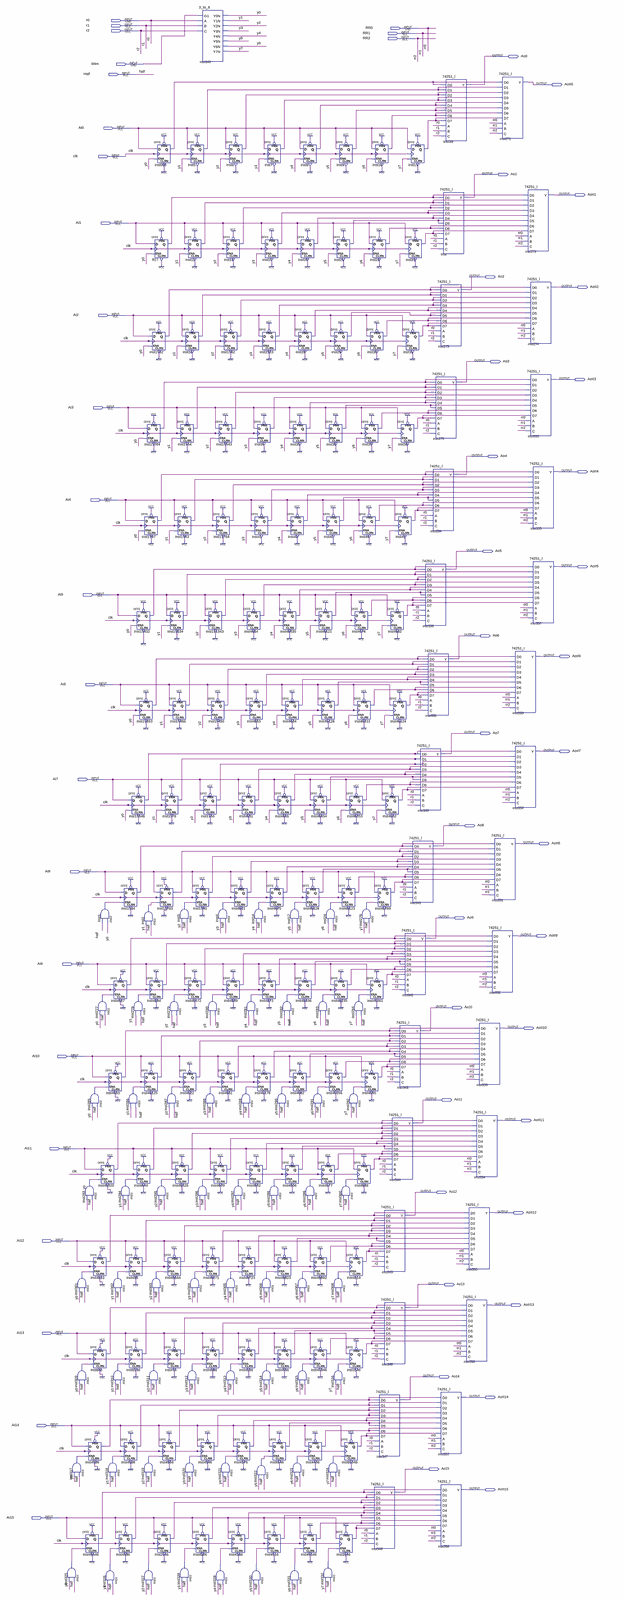
[diagram p0: schematic sheet, whole]
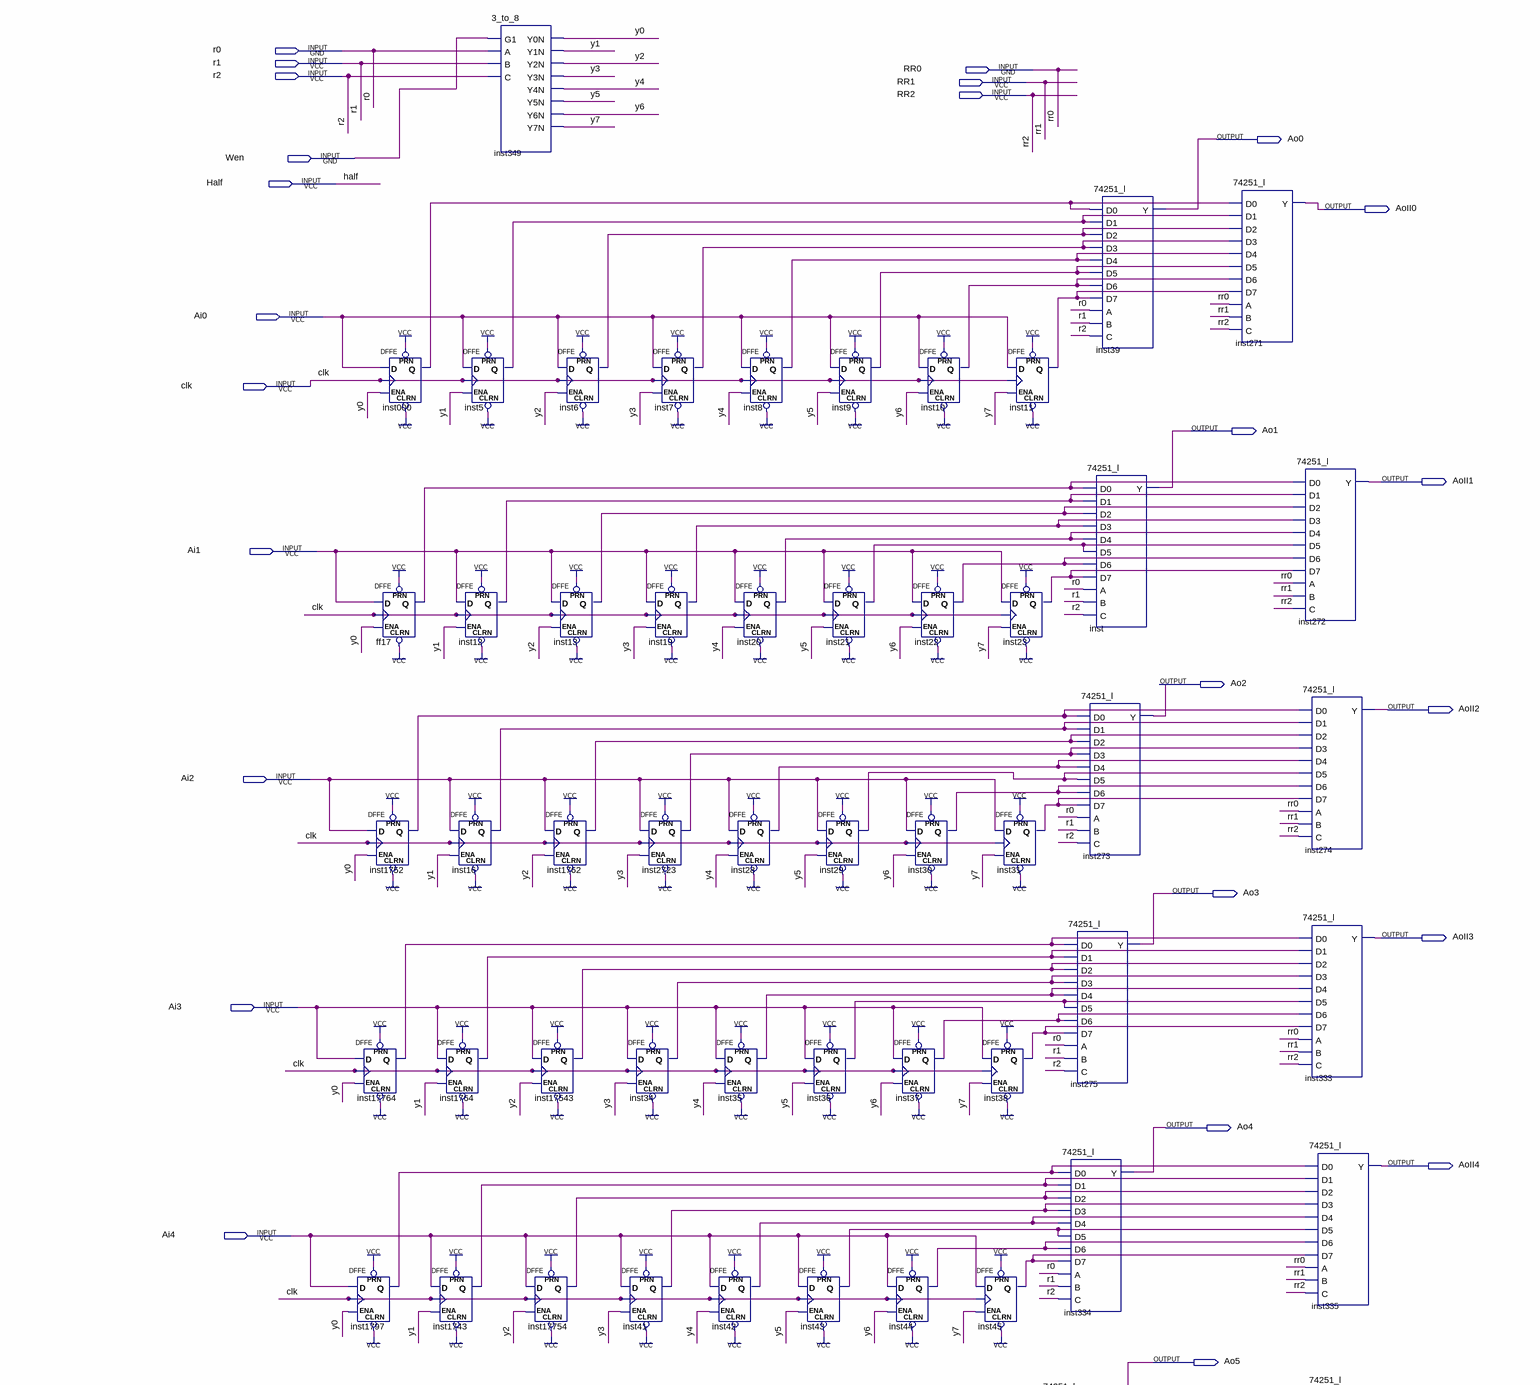
[diagram p1: schematic sheet, upper part]
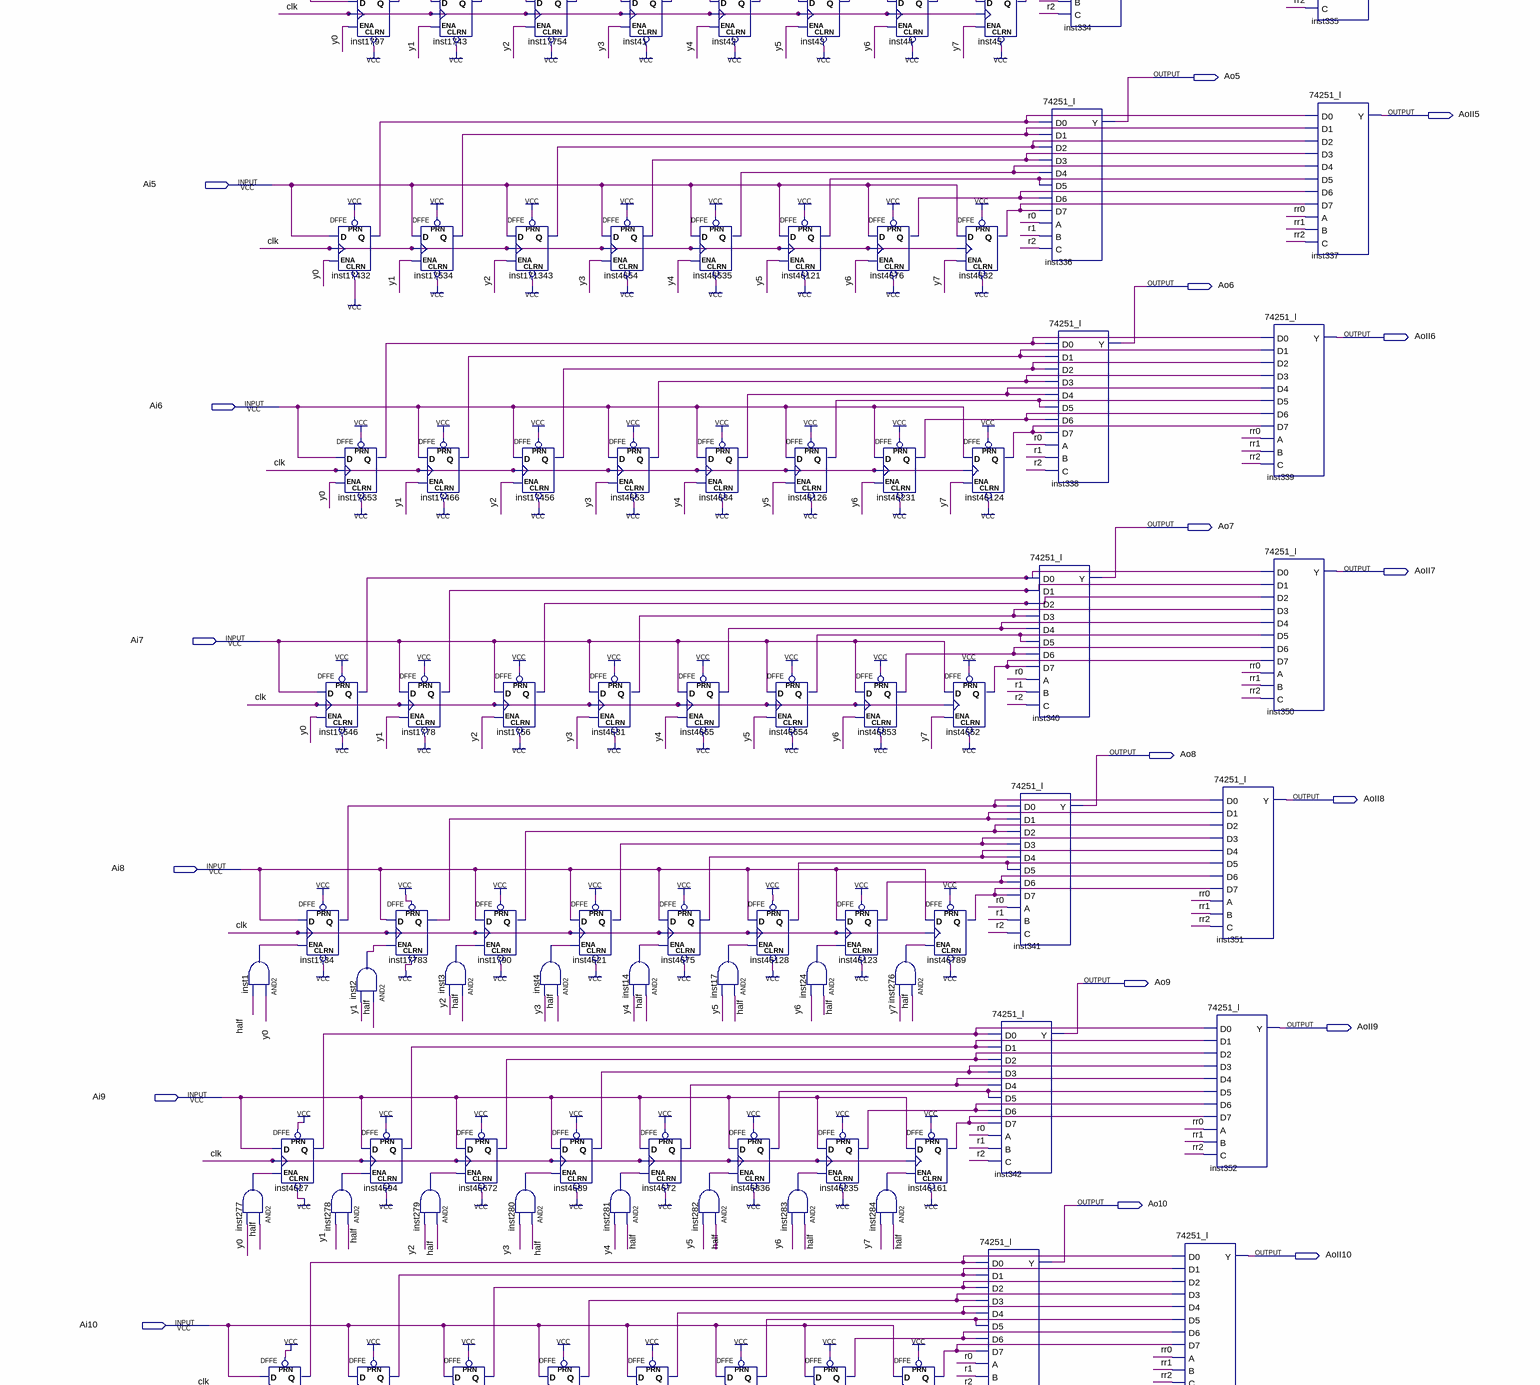
[diagram p2: schematic sheet, middle part]
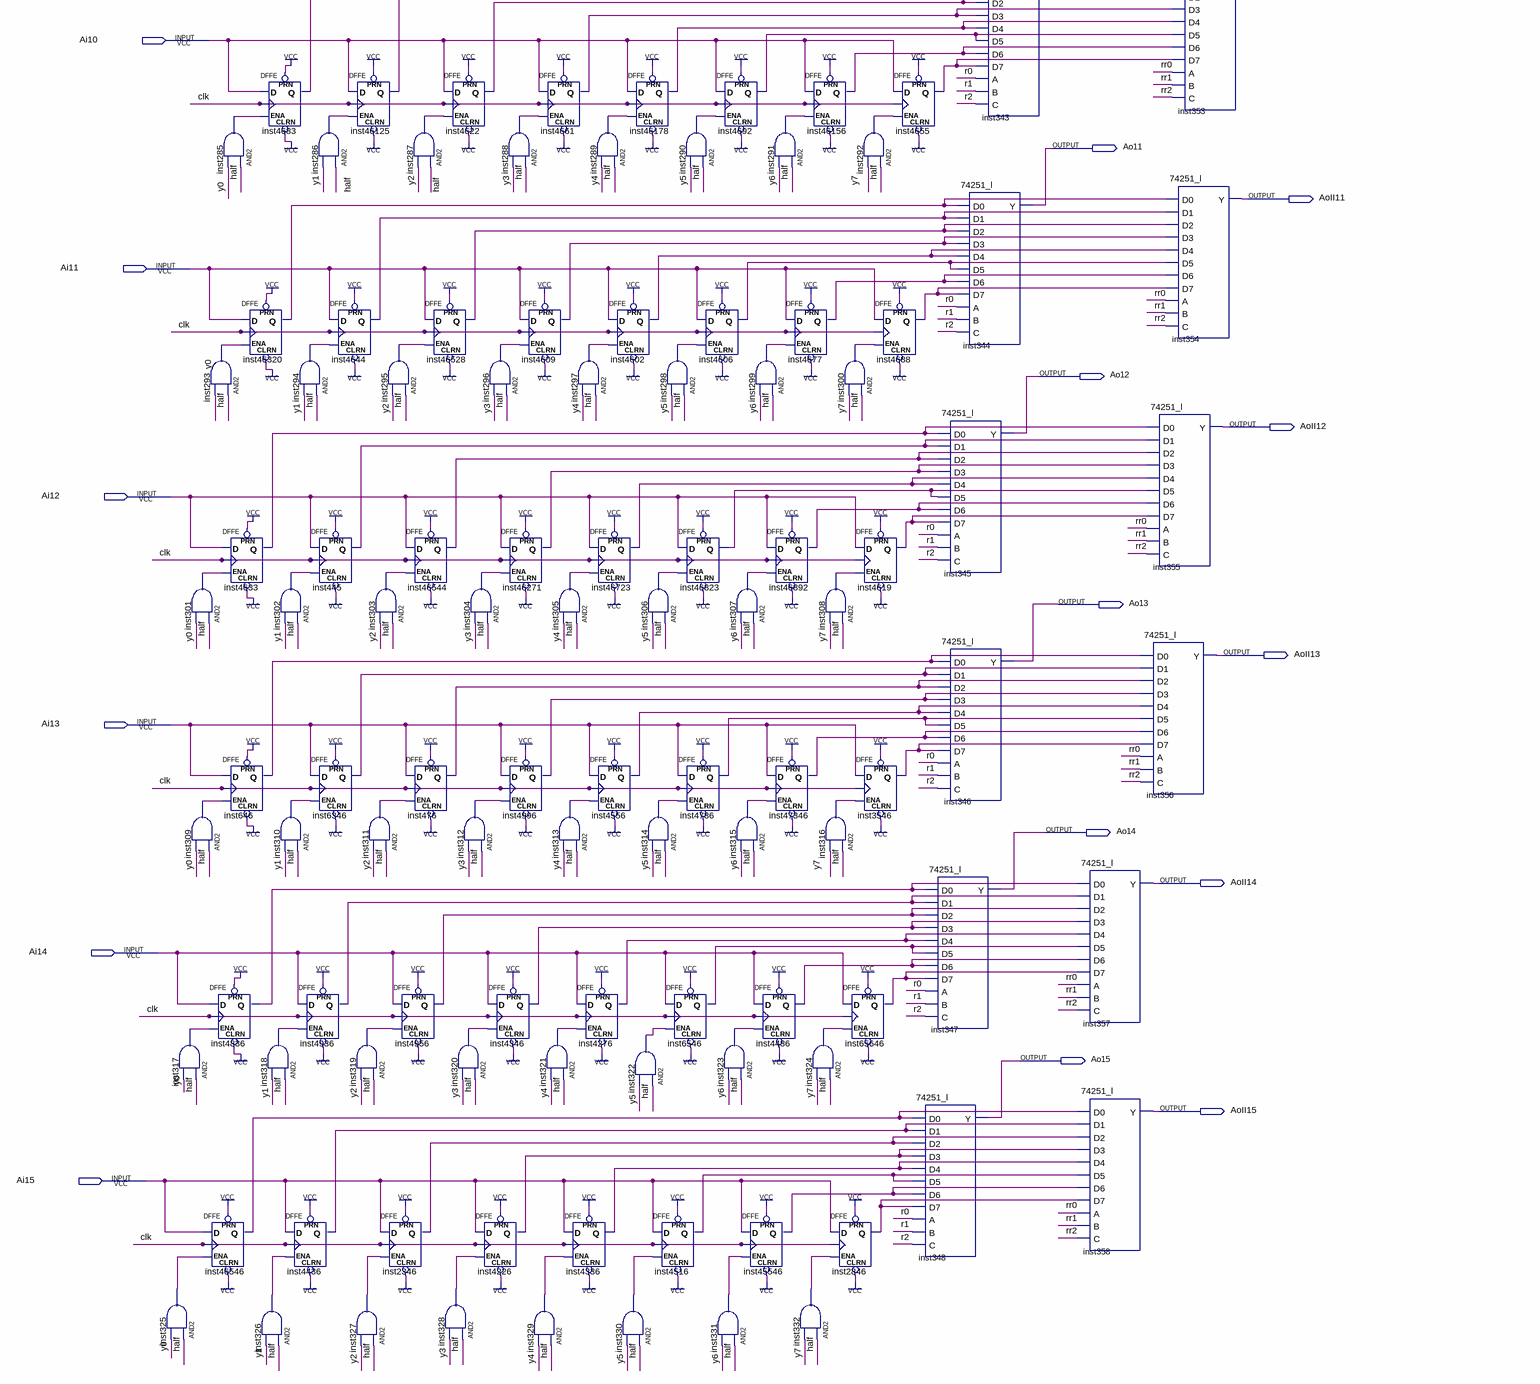
[diagram p3: schematic sheet, lower part]
// Quartus schematic regs.bdf as structural Verilog: 225 symbols, 57 pins
module regs (
  input  r0,
  input  r1,
  input  RR0,
  input  r2,
  input  RR1,
  input  RR2,
  input  Wen,
  input  Half,
  input  Ai0,
  input  clk,
  input  Ai1,
  input  Ai2,
  input  Ai3,
  input  Ai4,
  input  Ai5,
  input  Ai6,
  input  Ai7,
  input  Ai8,
  input  Ai9,
  input  Ai10,
  input  Ai11,
  input  Ai12,
  input  Ai13,
  input  Ai14,
  input  Ai15,
  output Ao0,
  output AoII0,
  output Ao1,
  output AoII1,
  output Ao2,
  output AoII2,
  output Ao3,
  output AoII3,
  output Ao4,
  output AoII4,
  output Ao5,
  output AoII5,
  output Ao6,
  output AoII6,
  output Ao7,
  output AoII7,
  output Ao8,
  output AoII8,
  output Ao9,
  output AoII9,
  output Ao10,
  output AoII10,
  output Ao11,
  output AoII11,
  output Ao12,
  output AoII12,
  output Ao13,
  output AoII13,
  output Ao14,
  output AoII14,
  output Ao15,
  output AoII15
);

  wire ff17_q, inst000_q, inst1_out, inst2_out, inst3_out, inst4_out, inst5_q, inst6_q, inst7_q, inst8_q,
       inst9_q, inst10_q, inst11_q, inst12_q, inst13_q, inst14_out, inst16_q, inst17_out, inst19_q, inst20_q,
       inst21_q, inst22_q, inst23_q, inst24_out, inst28_q, inst29_q, inst30_q, inst31_q, inst34_q, inst35_q,
       inst36_q, inst37_q, inst38_q, inst41_q, inst42_q, inst43_q, inst44_q, inst45_q, inst276_out,
       inst277_out, inst278_out, inst279_out, inst280_out, inst281_out, inst282_out, inst283_out,
       inst284_out, inst285_out, inst286_out, inst287_out, inst288_out, inst289_out, inst290_out,
       inst291_out, inst292_out, inst293_out, inst294_out, inst295_out, inst296_out, inst297_out,
       inst298_out, inst299_out, inst300_out, inst301_out, inst302_out, inst303_out, inst304_out,
       inst305_out, inst306_out, inst307_out, inst308_out, inst309_out, inst310_out, inst311_out,
       inst312_out, inst313_out, inst314_out, inst315_out, inst316_out, inst317_out, inst318_out,
       inst319_out, inst320_out, inst321_out, inst322_out, inst323_out, inst324_out, inst325_out,
       inst326_out, inst327_out, inst328_out, inst329_out, inst330_out, inst331_out, inst332_out, inst445_q,
       inst476_q, inst646_q, inst1734_q, inst1743_q, inst1752_q, inst1756_q, inst1762_q, inst1764_q,
       inst1778_q, inst1790_q, inst1797_q, inst2346_q, inst2723_q, inst2846_q, inst3546_q, inst4226_q,
       inst4276_q, inst4336_q, inst4346_q, inst4436_q, inst4486_q, inst4516_q, inst4556_q, inst4602_q,
       inst4606_q, inst4609_q, inst4619_q, inst4621_q, inst4622_q, inst4627_q, inst4631_q, inst4632_q,
       inst4633_q, inst4634_q, inst4644_q, inst4652_q, inst4653_q, inst4654_q, inst4655_q, inst4661_q,
       inst4665_q, inst4672_q, inst4675_q, inst4676_q, inst4677_q, inst4683_q, inst4688_q, inst4689_q,
       inst4692_q, inst4694_q, inst4786_q, inst4836_q, inst4936_q, inst4956_q, inst4996_q, inst6346_q,
       inst6546_q, inst17432_q, inst17456_q, inst17466_q, inst17534_q, inst17543_q, inst17546_q, inst17653_q,
       inst17754_q, inst17764_q, inst17783_q, inst45546_q, inst46121_q, inst46123_q, inst46124_q,
       inst46125_q, inst46126_q, inst46128_q, inst46156_q, inst46161_q, inst46178_q, inst46231_q,
       inst46235_q, inst46271_q, inst46320_q, inst46528_q, inst46535_q, inst46544_q, inst46546_q,
       inst46654_q, inst46672_q, inst46723_q, inst46789_q, inst46823_q, inst46836_q, inst46853_q,
       inst46892_q, inst47346_q, inst65646_q, inst171343_q, y0, y1, y2, y3, y4, y5, y6, y7;

  and inst301 (inst301_out, Half, y0);
  and inst309 (inst309_out, Half, y0);
  and inst317 (inst317_out, Half, y0);
  and inst325 (inst325_out, Half, y0);
  and inst1 (inst1_out, y0, Half);
  and inst277 (inst277_out, Half, y0);
  and inst285 (inst285_out, Half, y0);
  DFFE inst46320 (.PRN(1'b1), .CLRN(1'b1), .D(Ai11), .CLK(clk), .ENA(inst293_out), .Q(inst46320_q));
  and inst293 (inst293_out, Half, y0);
  DFFE inst4633 (.PRN(1'b1), .CLRN(1'b1), .D(Ai12), .CLK(clk), .ENA(inst301_out), .Q(inst4633_q));
  DFFE inst646 (.PRN(1'b1), .CLRN(1'b1), .D(Ai13), .CLK(clk), .ENA(inst309_out), .Q(inst646_q));
  DFFE inst4836 (.PRN(1'b1), .CLRN(1'b1), .D(Ai14), .CLK(clk), .ENA(inst317_out), .Q(inst4836_q));
  DFFE inst46546 (.PRN(1'b1), .CLRN(1'b1), .D(Ai15), .CLK(clk), .ENA(inst325_out), .Q(inst46546_q));
  DFFE inst1734 (.PRN(1'b1), .CLRN(1'b1), .D(Ai8), .CLK(clk), .ENA(inst1_out), .Q(inst1734_q));
  DFFE inst4627 (.PRN(1'b1), .CLRN(1'b1), .D(Ai9), .CLK(clk), .ENA(inst277_out), .Q(inst4627_q));
  DFFE inst4683 (.PRN(1'b1), .CLRN(1'b1), .D(Ai10), .CLK(clk), .ENA(inst285_out), .Q(inst4683_q));
  and inst294 (inst294_out, Half, y1);
  and inst302 (inst302_out, Half, y1);
  and inst310 (inst310_out, Half, y1);
  DFFE inst4936 (.PRN(1'b1), .CLRN(1'b1), .D(Ai14), .CLK(clk), .ENA(inst318_out), .Q(inst4936_q));
  and inst318 (inst318_out, Half, y1);
  DFFE inst4436 (.PRN(1'b1), .CLRN(1'b1), .D(Ai15), .CLK(clk), .ENA(inst326_out), .Q(inst4436_q));
  and inst326 (inst326_out, Half, y1);
  DFFE inst1797 (.PRN(1'b1), .CLRN(1'b1), .D(Ai4), .CLK(clk), .ENA(y0), .Q(inst1797_q));
  DFFE inst17432 (.PRN(1'b1), .CLRN(1'b1), .D(Ai5), .CLK(clk), .ENA(y0), .Q(inst17432_q));
  DFFE inst17653 (.PRN(1'b1), .CLRN(1'b1), .D(Ai6), .CLK(clk), .ENA(y0), .Q(inst17653_q));
  DFFE inst17546 (.PRN(1'b1), .CLRN(1'b1), .D(Ai7), .CLK(clk), .ENA(y0), .Q(inst17546_q));
  and inst2 (inst2_out, Half, y1);
  and inst278 (inst278_out, Half, y1);
  DFFE inst46125 (.PRN(1'b1), .CLRN(1'b1), .D(Ai10), .CLK(clk), .ENA(inst286_out), .Q(inst46125_q));
  and inst286 (inst286_out, Half, y1);
  DFFE inst4644 (.PRN(1'b1), .CLRN(1'b1), .D(Ai11), .CLK(clk), .ENA(inst294_out), .Q(inst4644_q));
  DFFE inst445 (.PRN(1'b1), .CLRN(1'b1), .D(Ai12), .CLK(clk), .ENA(inst302_out), .Q(inst445_q));
  DFFE inst6346 (.PRN(1'b1), .CLRN(1'b1), .D(Ai13), .CLK(clk), .ENA(inst310_out), .Q(inst6346_q));
  and inst319 (inst319_out, Half, y2);
  and inst327 (inst327_out, Half, y2);
  DFFE inst000 (.PRN(1'b1), .CLRN(1'b1), .D(Ai0), .CLK(clk), .ENA(y0), .Q(inst000_q));
  DFFE ff17 (.PRN(1'b1), .CLRN(1'b1), .D(Ai1), .CLK(clk), .ENA(y0), .Q(ff17_q));
  DFFE inst1752 (.PRN(1'b1), .CLRN(1'b1), .D(Ai2), .CLK(clk), .ENA(y0), .Q(inst1752_q));
  DFFE inst17764 (.PRN(1'b1), .CLRN(1'b1), .D(Ai3), .CLK(clk), .ENA(y0), .Q(inst17764_q));
  DFFE inst1778 (.PRN(1'b1), .CLRN(1'b1), .D(Ai7), .CLK(clk), .ENA(y1), .Q(inst1778_q));
  DFFE inst17783 (.PRN(1'b1), .CLRN(1'b1), .D(Ai8), .CLK(clk), .ENA(inst2_out), .Q(inst17783_q));
  DFFE inst4694 (.PRN(1'b1), .CLRN(1'b1), .D(Ai9), .CLK(clk), .ENA(inst278_out), .Q(inst4694_q));
  and inst295 (inst295_out, Half, y2);
  and inst303 (inst303_out, Half, y2);
  and inst311 (inst311_out, Half, y2);
  DFFE inst4956 (.PRN(1'b1), .CLRN(1'b1), .D(Ai14), .CLK(clk), .ENA(inst319_out), .Q(inst4956_q));
  DFFE inst2346 (.PRN(1'b1), .CLRN(1'b1), .D(Ai15), .CLK(clk), .ENA(inst327_out), .Q(inst2346_q));
  DFFE inst16 (.PRN(1'b1), .CLRN(1'b1), .D(Ai2), .CLK(clk), .ENA(y1), .Q(inst16_q));
  DFFE inst1764 (.PRN(1'b1), .CLRN(1'b1), .D(Ai3), .CLK(clk), .ENA(y1), .Q(inst1764_q));
  DFFE inst1743 (.PRN(1'b1), .CLRN(1'b1), .D(Ai4), .CLK(clk), .ENA(y1), .Q(inst1743_q));
  DFFE inst17534 (.PRN(1'b1), .CLRN(1'b1), .D(Ai5), .CLK(clk), .ENA(y1), .Q(inst17534_q));
  DFFE inst17466 (.PRN(1'b1), .CLRN(1'b1), .D(Ai6), .CLK(clk), .ENA(y1), .Q(inst17466_q));
  and inst3 (inst3_out, Half, y2);
  and inst279 (inst279_out, Half, y2);
  DFFE inst4622 (.PRN(1'b1), .CLRN(1'b1), .D(Ai10), .CLK(clk), .ENA(inst287_out), .Q(inst4622_q));
  and inst287 (inst287_out, Half, y2);
  DFFE inst46528 (.PRN(1'b1), .CLRN(1'b1), .D(Ai11), .CLK(clk), .ENA(inst295_out), .Q(inst46528_q));
  DFFE inst46544 (.PRN(1'b1), .CLRN(1'b1), .D(Ai12), .CLK(clk), .ENA(inst303_out), .Q(inst46544_q));
  DFFE inst476 (.PRN(1'b1), .CLRN(1'b1), .D(Ai13), .CLK(clk), .ENA(inst311_out), .Q(inst476_q));
  and inst320 (inst320_out, Half, y3);
  and inst328 (inst328_out, Half, y3);
  \3_to_8  inst349 (
    .G1(Wen), .A(r0), .B(r1), .C(r2), .Y0N(y0), .Y1N(y1), .Y2N(y2), .Y3N(y3), .Y4N(y4), .Y5N(y5), .Y6N(y6),
    .Y7N(y7));
  DFFE inst5 (.PRN(1'b1), .CLRN(1'b1), .D(Ai0), .CLK(clk), .ENA(y1), .Q(inst5_q));
  DFFE inst12 (.PRN(1'b1), .CLRN(1'b1), .D(Ai1), .CLK(clk), .ENA(y1), .Q(inst12_q));
  DFFE inst1756 (.PRN(1'b1), .CLRN(1'b1), .D(Ai7), .CLK(clk), .ENA(y2), .Q(inst1756_q));
  DFFE inst1790 (.PRN(1'b1), .CLRN(1'b1), .D(Ai8), .CLK(clk), .ENA(inst3_out), .Q(inst1790_q));
  DFFE inst46672 (.PRN(1'b1), .CLRN(1'b1), .D(Ai9), .CLK(clk), .ENA(inst279_out), .Q(inst46672_q));
  and inst288 (inst288_out, Half, y3);
  and inst296 (inst296_out, Half, y3);
  DFFE inst46271 (.PRN(1'b1), .CLRN(1'b1), .D(Ai12), .CLK(clk), .ENA(inst304_out), .Q(inst46271_q));
  and inst304 (inst304_out, Half, y3);
  DFFE inst4996 (.PRN(1'b1), .CLRN(1'b1), .D(Ai13), .CLK(clk), .ENA(inst312_out), .Q(inst4996_q));
  and inst312 (inst312_out, Half, y3);
  DFFE inst4346 (.PRN(1'b1), .CLRN(1'b1), .D(Ai14), .CLK(clk), .ENA(inst320_out), .Q(inst4346_q));
  DFFE inst4226 (.PRN(1'b1), .CLRN(1'b1), .D(Ai15), .CLK(clk), .ENA(inst328_out), .Q(inst4226_q));
  DFFE inst13 (.PRN(1'b1), .CLRN(1'b1), .D(Ai1), .CLK(clk), .ENA(y2), .Q(inst13_q));
  DFFE inst1762 (.PRN(1'b1), .CLRN(1'b1), .D(Ai2), .CLK(clk), .ENA(y2), .Q(inst1762_q));
  DFFE inst17543 (.PRN(1'b1), .CLRN(1'b1), .D(Ai3), .CLK(clk), .ENA(y2), .Q(inst17543_q));
  DFFE inst17754 (.PRN(1'b1), .CLRN(1'b1), .D(Ai4), .CLK(clk), .ENA(y2), .Q(inst17754_q));
  DFFE inst171343 (.PRN(1'b1), .CLRN(1'b1), .D(Ai5), .CLK(clk), .ENA(y2), .Q(inst171343_q));
  DFFE inst17456 (.PRN(1'b1), .CLRN(1'b1), .D(Ai6), .CLK(clk), .ENA(y2), .Q(inst17456_q));
  and inst4 (inst4_out, Half, y3);
  DFFE inst4689 (.PRN(1'b1), .CLRN(1'b1), .D(Ai9), .CLK(clk), .ENA(inst280_out), .Q(inst4689_q));
  and inst280 (inst280_out, Half, y3);
  DFFE inst4661 (.PRN(1'b1), .CLRN(1'b1), .D(Ai10), .CLK(clk), .ENA(inst288_out), .Q(inst4661_q));
  DFFE inst4609 (.PRN(1'b1), .CLRN(1'b1), .D(Ai11), .CLK(clk), .ENA(inst296_out), .Q(inst4609_q));
  and inst305 (inst305_out, Half, y4);
  and inst313 (inst313_out, Half, y4);
  and inst321 (inst321_out, Half, y4);
  and inst329 (inst329_out, Half, y4);
  DFFE inst6 (.PRN(1'b1), .CLRN(1'b1), .D(Ai0), .CLK(clk), .ENA(y2), .Q(inst6_q));
  DFFE inst4654 (.PRN(1'b1), .CLRN(1'b1), .D(Ai5), .CLK(clk), .ENA(y3), .Q(inst4654_q));
  DFFE inst4631 (.PRN(1'b1), .CLRN(1'b1), .D(Ai7), .CLK(clk), .ENA(y3), .Q(inst4631_q));
  DFFE inst4621 (.PRN(1'b1), .CLRN(1'b1), .D(Ai8), .CLK(clk), .ENA(inst4_out), .Q(inst4621_q));
  and inst281 (inst281_out, Half, y4);
  and inst289 (inst289_out, Half, y4);
  and inst297 (inst297_out, Half, y4);
  DFFE inst46723 (.PRN(1'b1), .CLRN(1'b1), .D(Ai12), .CLK(clk), .ENA(inst305_out), .Q(inst46723_q));
  DFFE inst4556 (.PRN(1'b1), .CLRN(1'b1), .D(Ai13), .CLK(clk), .ENA(inst313_out), .Q(inst4556_q));
  DFFE inst4276 (.PRN(1'b1), .CLRN(1'b1), .D(Ai14), .CLK(clk), .ENA(inst321_out), .Q(inst4276_q));
  DFFE inst4336 (.PRN(1'b1), .CLRN(1'b1), .D(Ai15), .CLK(clk), .ENA(inst329_out), .Q(inst4336_q));
  DFFE inst7 (.PRN(1'b1), .CLRN(1'b1), .D(Ai0), .CLK(clk), .ENA(y3), .Q(inst7_q));
  DFFE inst19 (.PRN(1'b1), .CLRN(1'b1), .D(Ai1), .CLK(clk), .ENA(y3), .Q(inst19_q));
  DFFE inst2723 (.PRN(1'b1), .CLRN(1'b1), .D(Ai2), .CLK(clk), .ENA(y3), .Q(inst2723_q));
  DFFE inst34 (.PRN(1'b1), .CLRN(1'b1), .D(Ai3), .CLK(clk), .ENA(y3), .Q(inst34_q));
  DFFE inst41 (.PRN(1'b1), .CLRN(1'b1), .D(Ai4), .CLK(clk), .ENA(y3), .Q(inst41_q));
  DFFE inst4653 (.PRN(1'b1), .CLRN(1'b1), .D(Ai6), .CLK(clk), .ENA(y3), .Q(inst4653_q));
  and inst14 (inst14_out, Half, y4);
  DFFE inst4672 (.PRN(1'b1), .CLRN(1'b1), .D(Ai9), .CLK(clk), .ENA(inst281_out), .Q(inst4672_q));
  DFFE inst46178 (.PRN(1'b1), .CLRN(1'b1), .D(Ai10), .CLK(clk), .ENA(inst289_out), .Q(inst46178_q));
  DFFE inst4602 (.PRN(1'b1), .CLRN(1'b1), .D(Ai11), .CLK(clk), .ENA(inst297_out), .Q(inst4602_q));
  and inst306 (inst306_out, Half, y5);
  and inst314 (inst314_out, Half, y5);
  and inst322 (inst322_out, Half, y5);
  DFFE inst4516 (.PRN(1'b1), .CLRN(1'b1), .D(Ai15), .CLK(clk), .ENA(inst330_out), .Q(inst4516_q));
  and inst330 (inst330_out, Half, y5);
  DFFE inst46535 (.PRN(1'b1), .CLRN(1'b1), .D(Ai5), .CLK(clk), .ENA(y4), .Q(inst46535_q));
  DFFE inst4634 (.PRN(1'b1), .CLRN(1'b1), .D(Ai6), .CLK(clk), .ENA(y4), .Q(inst4634_q));
  DFFE inst4665 (.PRN(1'b1), .CLRN(1'b1), .D(Ai7), .CLK(clk), .ENA(y4), .Q(inst4665_q));
  DFFE inst4675 (.PRN(1'b1), .CLRN(1'b1), .D(Ai8), .CLK(clk), .ENA(inst14_out), .Q(inst4675_q));
  and inst282 (inst282_out, Half, y5);
  and inst290 (inst290_out, Half, y5);
  DFFE inst4606 (.PRN(1'b1), .CLRN(1'b1), .D(Ai11), .CLK(clk), .ENA(inst298_out), .Q(inst4606_q));
  and inst298 (inst298_out, Half, y5);
  DFFE inst46823 (.PRN(1'b1), .CLRN(1'b1), .D(Ai12), .CLK(clk), .ENA(inst306_out), .Q(inst46823_q));
  DFFE inst4786 (.PRN(1'b1), .CLRN(1'b1), .D(Ai13), .CLK(clk), .ENA(inst314_out), .Q(inst4786_q));
  DFFE inst6546 (.PRN(1'b1), .CLRN(1'b1), .D(Ai14), .CLK(clk), .ENA(inst322_out), .Q(inst6546_q));
  DFFE inst8 (.PRN(1'b1), .CLRN(1'b1), .D(Ai0), .CLK(clk), .ENA(y4), .Q(inst8_q));
  DFFE inst20 (.PRN(1'b1), .CLRN(1'b1), .D(Ai1), .CLK(clk), .ENA(y4), .Q(inst20_q));
  DFFE inst28 (.PRN(1'b1), .CLRN(1'b1), .D(Ai2), .CLK(clk), .ENA(y4), .Q(inst28_q));
  DFFE inst35 (.PRN(1'b1), .CLRN(1'b1), .D(Ai3), .CLK(clk), .ENA(y4), .Q(inst35_q));
  DFFE inst42 (.PRN(1'b1), .CLRN(1'b1), .D(Ai4), .CLK(clk), .ENA(y4), .Q(inst42_q));
  DFFE inst46128 (.PRN(1'b1), .CLRN(1'b1), .D(Ai8), .CLK(clk), .ENA(inst17_out), .Q(inst46128_q));
  and inst17 (inst17_out, Half, y5);
  DFFE inst46836 (.PRN(1'b1), .CLRN(1'b1), .D(Ai9), .CLK(clk), .ENA(inst282_out), .Q(inst46836_q));
  DFFE inst4692 (.PRN(1'b1), .CLRN(1'b1), .D(Ai10), .CLK(clk), .ENA(inst290_out), .Q(inst4692_q));
  and inst299 (inst299_out, Half, y6);
  and inst307 (inst307_out, Half, y6);
  and inst315 (inst315_out, Half, y6);
  DFFE inst4486 (.PRN(1'b1), .CLRN(1'b1), .D(Ai14), .CLK(clk), .ENA(inst323_out), .Q(inst4486_q));
  and inst323 (inst323_out, Half, y6);
  DFFE inst45546 (.PRN(1'b1), .CLRN(1'b1), .D(Ai15), .CLK(clk), .ENA(inst331_out), .Q(inst45546_q));
  and inst331 (inst331_out, Half, y6);
  DFFE inst36 (.PRN(1'b1), .CLRN(1'b1), .D(Ai3), .CLK(clk), .ENA(y5), .Q(inst36_q));
  DFFE inst43 (.PRN(1'b1), .CLRN(1'b1), .D(Ai4), .CLK(clk), .ENA(y5), .Q(inst43_q));
  DFFE inst46121 (.PRN(1'b1), .CLRN(1'b1), .D(Ai5), .CLK(clk), .ENA(y5), .Q(inst46121_q));
  DFFE inst46126 (.PRN(1'b1), .CLRN(1'b1), .D(Ai6), .CLK(clk), .ENA(y5), .Q(inst46126_q));
  DFFE inst46654 (.PRN(1'b1), .CLRN(1'b1), .D(Ai7), .CLK(clk), .ENA(y5), .Q(inst46654_q));
  and inst24 (inst24_out, Half, y6);
  and inst283 (inst283_out, Half, y6);
  DFFE inst46156 (.PRN(1'b1), .CLRN(1'b1), .D(Ai10), .CLK(clk), .ENA(inst291_out), .Q(inst46156_q));
  and inst291 (inst291_out, Half, y6);
  DFFE inst4677 (.PRN(1'b1), .CLRN(1'b1), .D(Ai11), .CLK(clk), .ENA(inst299_out), .Q(inst4677_q));
  DFFE inst46892 (.PRN(1'b1), .CLRN(1'b1), .D(Ai12), .CLK(clk), .ENA(inst307_out), .Q(inst46892_q));
  DFFE inst47346 (.PRN(1'b1), .CLRN(1'b1), .D(Ai13), .CLK(clk), .ENA(inst315_out), .Q(inst47346_q));
  and inst324 (inst324_out, Half, y7);
  and inst332 (inst332_out, Half, y7);
  DFFE inst9 (.PRN(1'b1), .CLRN(1'b1), .D(Ai0), .CLK(clk), .ENA(y5), .Q(inst9_q));
  DFFE inst21 (.PRN(1'b1), .CLRN(1'b1), .D(Ai1), .CLK(clk), .ENA(y5), .Q(inst21_q));
  DFFE inst29 (.PRN(1'b1), .CLRN(1'b1), .D(Ai2), .CLK(clk), .ENA(y5), .Q(inst29_q));
  DFFE inst46853 (.PRN(1'b1), .CLRN(1'b1), .D(Ai7), .CLK(clk), .ENA(y6), .Q(inst46853_q));
  DFFE inst46123 (.PRN(1'b1), .CLRN(1'b1), .D(Ai8), .CLK(clk), .ENA(inst24_out), .Q(inst46123_q));
  DFFE inst46235 (.PRN(1'b1), .CLRN(1'b1), .D(Ai9), .CLK(clk), .ENA(inst283_out), .Q(inst46235_q));
  and inst292 (inst292_out, Half, y7);
  and inst300 (inst300_out, Half, y7);
  DFFE inst4619 (.PRN(1'b1), .CLRN(1'b1), .D(Ai12), .CLK(clk), .ENA(inst308_out), .Q(inst4619_q));
  and inst308 (inst308_out, Half, y7);
  DFFE inst3546 (.PRN(1'b1), .CLRN(1'b1), .D(Ai13), .CLK(clk), .ENA(inst316_out), .Q(inst3546_q));
  and inst316 (inst316_out, Half, y7);
  DFFE inst65646 (.PRN(1'b1), .CLRN(1'b1), .D(Ai14), .CLK(clk), .ENA(inst324_out), .Q(inst65646_q));
  DFFE inst2846 (.PRN(1'b1), .CLRN(1'b1), .D(Ai15), .CLK(clk), .ENA(inst332_out), .Q(inst2846_q));
  DFFE inst30 (.PRN(1'b1), .CLRN(1'b1), .D(Ai2), .CLK(clk), .ENA(y6), .Q(inst30_q));
  DFFE inst37 (.PRN(1'b1), .CLRN(1'b1), .D(Ai3), .CLK(clk), .ENA(y6), .Q(inst37_q));
  DFFE inst44 (.PRN(1'b1), .CLRN(1'b1), .D(Ai4), .CLK(clk), .ENA(y6), .Q(inst44_q));
  DFFE inst4676 (.PRN(1'b1), .CLRN(1'b1), .D(Ai5), .CLK(clk), .ENA(y6), .Q(inst4676_q));
  DFFE inst46231 (.PRN(1'b1), .CLRN(1'b1), .D(Ai6), .CLK(clk), .ENA(y6), .Q(inst46231_q));
  and inst276 (inst276_out, Half, y7);
  DFFE inst46161 (.PRN(1'b1), .CLRN(1'b1), .D(Ai9), .CLK(clk), .ENA(inst284_out), .Q(inst46161_q));
  and inst284 (inst284_out, Half, y7);
  DFFE inst4655 (.PRN(1'b1), .CLRN(1'b1), .D(Ai10), .CLK(clk), .ENA(inst292_out), .Q(inst4655_q));
  DFFE inst4688 (.PRN(1'b1), .CLRN(1'b1), .D(Ai11), .CLK(clk), .ENA(inst300_out), .Q(inst4688_q));
  DFFE inst10 (.PRN(1'b1), .CLRN(1'b1), .D(Ai0), .CLK(clk), .ENA(y6), .Q(inst10_q));
  DFFE inst22 (.PRN(1'b1), .CLRN(1'b1), .D(Ai1), .CLK(clk), .ENA(y6), .Q(inst22_q));
  DFFE inst4632 (.PRN(1'b1), .CLRN(1'b1), .D(Ai5), .CLK(clk), .ENA(y7), .Q(inst4632_q));
  DFFE inst4652 (.PRN(1'b1), .CLRN(1'b1), .D(Ai7), .CLK(clk), .ENA(y7), .Q(inst4652_q));
  DFFE inst46789 (.PRN(1'b1), .CLRN(1'b1), .D(Ai8), .CLK(clk), .ENA(inst276_out), .Q(inst46789_q));
  \74251_l  inst344 (
    .D0(inst46320_q), .D1(inst4644_q), .D2(inst46528_q), .D3(inst4609_q), .D4(inst4602_q), .D5(inst4606_q),
    .D6(inst4677_q), .D7(inst4688_q), .A(r0), .B(r1), .C(r2), .Y(Ao11));
  \74251_l  inst345 (
    .D0(inst4633_q), .D1(inst445_q), .D2(inst46544_q), .D3(inst46271_q), .D4(inst46723_q), .D5(inst46823_q),
    .D6(inst46892_q), .D7(inst4619_q), .A(r0), .B(r1), .C(r2), .Y(Ao12));
  \74251_l  inst346 (
    .D0(inst646_q), .D1(inst6346_q), .D2(inst476_q), .D3(inst4996_q), .D4(inst4556_q), .D5(inst4786_q),
    .D6(inst47346_q), .D7(inst3546_q), .A(r0), .B(r1), .C(r2), .Y(Ao13));
  \74251_l  inst347 (
    .D0(inst4836_q), .D1(inst4936_q), .D2(inst4956_q), .D3(inst4346_q), .D4(inst4276_q), .D5(inst6546_q),
    .D6(inst4486_q), .D7(inst65646_q), .A(r0), .B(r1), .C(r2), .Y(Ao14));
  \74251_l  inst348 (
    .D0(inst46546_q), .D1(inst4436_q), .D2(inst2346_q), .D3(inst4226_q), .D4(inst4336_q), .D5(inst4516_q),
    .D6(inst45546_q), .D7(inst2846_q), .A(r0), .B(r1), .C(r2), .Y(Ao15));
  DFFE inst11 (.PRN(1'b1), .CLRN(1'b1), .D(Ai0), .CLK(clk), .ENA(y7), .Q(inst11_q));
  DFFE inst23 (.PRN(1'b1), .CLRN(1'b1), .D(Ai1), .CLK(clk), .ENA(y7), .Q(inst23_q));
  DFFE inst31 (.PRN(1'b1), .CLRN(1'b1), .D(Ai2), .CLK(clk), .ENA(y7), .Q(inst31_q));
  DFFE inst38 (.PRN(1'b1), .CLRN(1'b1), .D(Ai3), .CLK(clk), .ENA(y7), .Q(inst38_q));
  DFFE inst45 (.PRN(1'b1), .CLRN(1'b1), .D(Ai4), .CLK(clk), .ENA(y7), .Q(inst45_q));
  DFFE inst46124 (.PRN(1'b1), .CLRN(1'b1), .D(Ai6), .CLK(clk), .ENA(y7), .Q(inst46124_q));
  \74251_l  inst341 (
    .D0(inst1734_q), .D1(inst17783_q), .D2(inst1790_q), .D3(inst4621_q), .D4(inst4675_q), .D5(inst46128_q),
    .D6(inst46123_q), .D7(inst46789_q), .A(r0), .B(r1), .C(r2), .Y(Ao8));
  \74251_l  inst342 (
    .D0(inst4627_q), .D1(inst4694_q), .D2(inst46672_q), .D3(inst4689_q), .D4(inst4672_q), .D5(inst46836_q),
    .D6(inst46235_q), .D7(inst46161_q), .A(r0), .B(r1), .C(r2), .Y(Ao9));
  \74251_l  inst343 (
    .D0(inst4683_q), .D1(inst46125_q), .D2(inst4622_q), .D3(inst4661_q), .D4(inst46178_q), .D5(inst4692_q),
    .D6(inst46156_q), .D7(inst4655_q), .A(r0), .B(r1), .C(r2), .Y(Ao10));
  \74251_l  inst334 (
    .D0(inst1797_q), .D1(inst1743_q), .D2(inst17754_q), .D3(inst41_q), .D4(inst42_q), .D5(inst43_q),
    .D6(inst44_q), .D7(inst45_q), .A(r0), .B(r1), .C(r2), .Y(Ao4));
  \74251_l  inst336 (
    .D0(inst17432_q), .D1(inst17534_q), .D2(inst171343_q), .D3(inst4654_q), .D4(inst46535_q),
    .D5(inst46121_q), .D6(inst4676_q), .D7(inst4632_q), .A(r0), .B(r1), .C(r2), .Y(Ao5));
  \74251_l  inst338 (
    .D0(inst17653_q), .D1(inst17466_q), .D2(inst17456_q), .D3(inst4653_q), .D4(inst4634_q), .D5(inst46126_q),
    .D6(inst46231_q), .D7(inst46124_q), .A(r0), .B(r1), .C(r2), .Y(Ao6));
  \74251_l  inst340 (
    .D0(inst17546_q), .D1(inst1778_q), .D2(inst1756_q), .D3(inst4631_q), .D4(inst4665_q), .D5(inst46654_q),
    .D6(inst46853_q), .D7(inst4652_q), .A(r0), .B(r1), .C(r2), .Y(Ao7));
  \74251_l  inst39 (
    .D0(inst000_q), .D1(inst5_q), .D2(inst6_q), .D3(inst7_q), .D4(inst8_q), .D5(inst9_q), .D6(inst10_q),
    .D7(inst11_q), .A(r0), .B(r1), .C(r2), .Y(Ao0));
  \74251_l  inst (
    .D0(ff17_q), .D1(inst12_q), .D2(inst13_q), .D3(inst19_q), .D4(inst20_q), .D5(inst21_q), .D6(inst22_q),
    .D7(inst23_q), .A(r0), .B(r1), .C(r2), .Y(Ao1));
  \74251_l  inst273 (
    .D0(inst1752_q), .D1(inst16_q), .D2(inst1762_q), .D3(inst2723_q), .D4(inst28_q), .D5(inst29_q),
    .D6(inst30_q), .D7(inst31_q), .A(r0), .B(r1), .C(r2), .Y(Ao2));
  \74251_l  inst275 (
    .D0(inst17764_q), .D1(inst1764_q), .D2(inst17543_q), .D3(inst34_q), .D4(inst35_q), .D5(inst36_q),
    .D6(inst37_q), .D7(inst38_q), .A(r0), .B(r1), .C(r2), .Y(Ao3));
  \74251_l  inst357 (
    .D0(inst4836_q), .D1(inst4936_q), .D2(inst4956_q), .D3(inst4346_q), .D4(inst4276_q), .D5(inst6546_q),
    .D6(inst4486_q), .D7(inst65646_q), .A(RR0), .B(RR1), .C(RR2), .Y(AoII14));
  \74251_l  inst358 (
    .D0(inst46546_q), .D1(inst4436_q), .D2(inst2346_q), .D3(inst4226_q), .D4(inst4336_q), .D5(inst4516_q),
    .D6(inst45546_q), .D7(inst2846_q), .A(RR0), .B(RR1), .C(RR2), .Y(AoII15));
  \74251_l  inst355 (
    .D0(inst4633_q), .D1(inst445_q), .D2(inst46544_q), .D3(inst46271_q), .D4(inst46723_q), .D5(inst46823_q),
    .D6(inst46892_q), .D7(inst4619_q), .A(RR0), .B(RR1), .C(RR2), .Y(AoII12));
  \74251_l  inst356 (
    .D0(inst646_q), .D1(inst6346_q), .D2(inst476_q), .D3(inst4996_q), .D4(inst4556_q), .D5(inst4786_q),
    .D6(inst47346_q), .D7(inst3546_q), .A(RR0), .B(RR1), .C(RR2), .Y(AoII13));
  \74251_l  inst351 (
    .D0(inst1734_q), .D1(inst17783_q), .D2(inst1790_q), .D3(inst4621_q), .D4(inst4675_q), .D5(inst46128_q),
    .D6(inst46123_q), .D7(inst46789_q), .A(RR0), .B(RR1), .C(RR2), .Y(AoII8));
  \74251_l  inst352 (
    .D0(inst4627_q), .D1(inst4694_q), .D2(inst46672_q), .D3(inst4689_q), .D4(inst4672_q), .D5(inst46836_q),
    .D6(inst46235_q), .D7(inst46161_q), .A(RR0), .B(RR1), .C(RR2), .Y(AoII9));
  \74251_l  inst353 (
    .D0(inst4683_q), .D1(inst46125_q), .D2(inst4622_q), .D3(inst4661_q), .D4(inst46178_q), .D5(inst4692_q),
    .D6(inst46156_q), .D7(inst4655_q), .A(RR0), .B(RR1), .C(RR2), .Y(AoII10));
  \74251_l  inst354 (
    .D0(inst46320_q), .D1(inst4644_q), .D2(inst46528_q), .D3(inst4609_q), .D4(inst4602_q), .D5(inst4606_q),
    .D6(inst4677_q), .D7(inst4688_q), .A(RR0), .B(RR1), .C(RR2), .Y(AoII11));
  \74251_l  inst271 (
    .D0(inst000_q), .D1(inst5_q), .D2(inst6_q), .D3(inst7_q), .D4(inst8_q), .D5(inst9_q), .D6(inst10_q),
    .D7(inst11_q), .A(RR0), .B(RR1), .C(RR2), .Y(AoII0));
  \74251_l  inst339 (
    .D0(inst17653_q), .D1(inst17466_q), .D2(inst17456_q), .D3(inst4653_q), .D4(inst4634_q), .D5(inst46126_q),
    .D6(inst46231_q), .D7(inst46124_q), .A(RR0), .B(RR1), .C(RR2), .Y(AoII6));
  \74251_l  inst350 (
    .D0(inst17546_q), .D1(inst1778_q), .D2(inst1756_q), .D3(inst4631_q), .D4(inst4665_q), .D5(inst46654_q),
    .D6(inst46853_q), .D7(inst4652_q), .A(RR0), .B(RR1), .C(RR2), .Y(AoII7));
  \74251_l  inst272 (
    .D0(ff17_q), .D1(inst12_q), .D2(inst13_q), .D3(inst19_q), .D4(inst20_q), .D5(inst21_q), .D6(inst22_q),
    .D7(inst23_q), .A(RR0), .B(RR1), .C(RR2), .Y(AoII1));
  \74251_l  inst274 (
    .D0(inst1752_q), .D1(inst16_q), .D2(inst1762_q), .D3(inst2723_q), .D4(inst28_q), .D5(inst29_q),
    .D6(inst30_q), .D7(inst31_q), .A(RR0), .B(RR1), .C(RR2), .Y(AoII2));
  \74251_l  inst333 (
    .D0(inst17764_q), .D1(inst1764_q), .D2(inst17543_q), .D3(inst34_q), .D4(inst35_q), .D5(inst36_q),
    .D6(inst37_q), .D7(inst38_q), .A(RR0), .B(RR1), .C(RR2), .Y(AoII3));
  \74251_l  inst335 (
    .D0(inst1797_q), .D1(inst1743_q), .D2(inst17754_q), .D3(inst41_q), .D4(inst42_q), .D5(inst43_q),
    .D6(inst44_q), .D7(inst45_q), .A(RR0), .B(RR1), .C(RR2), .Y(AoII4));
  \74251_l  inst337 (
    .D0(inst17432_q), .D1(inst17534_q), .D2(inst171343_q), .D3(inst4654_q), .D4(inst46535_q),
    .D5(inst46121_q), .D6(inst4676_q), .D7(inst4632_q), .A(RR0), .B(RR1), .C(RR2), .Y(AoII5));
endmodule
